# Altium project PCB_Project2.PrjPCB
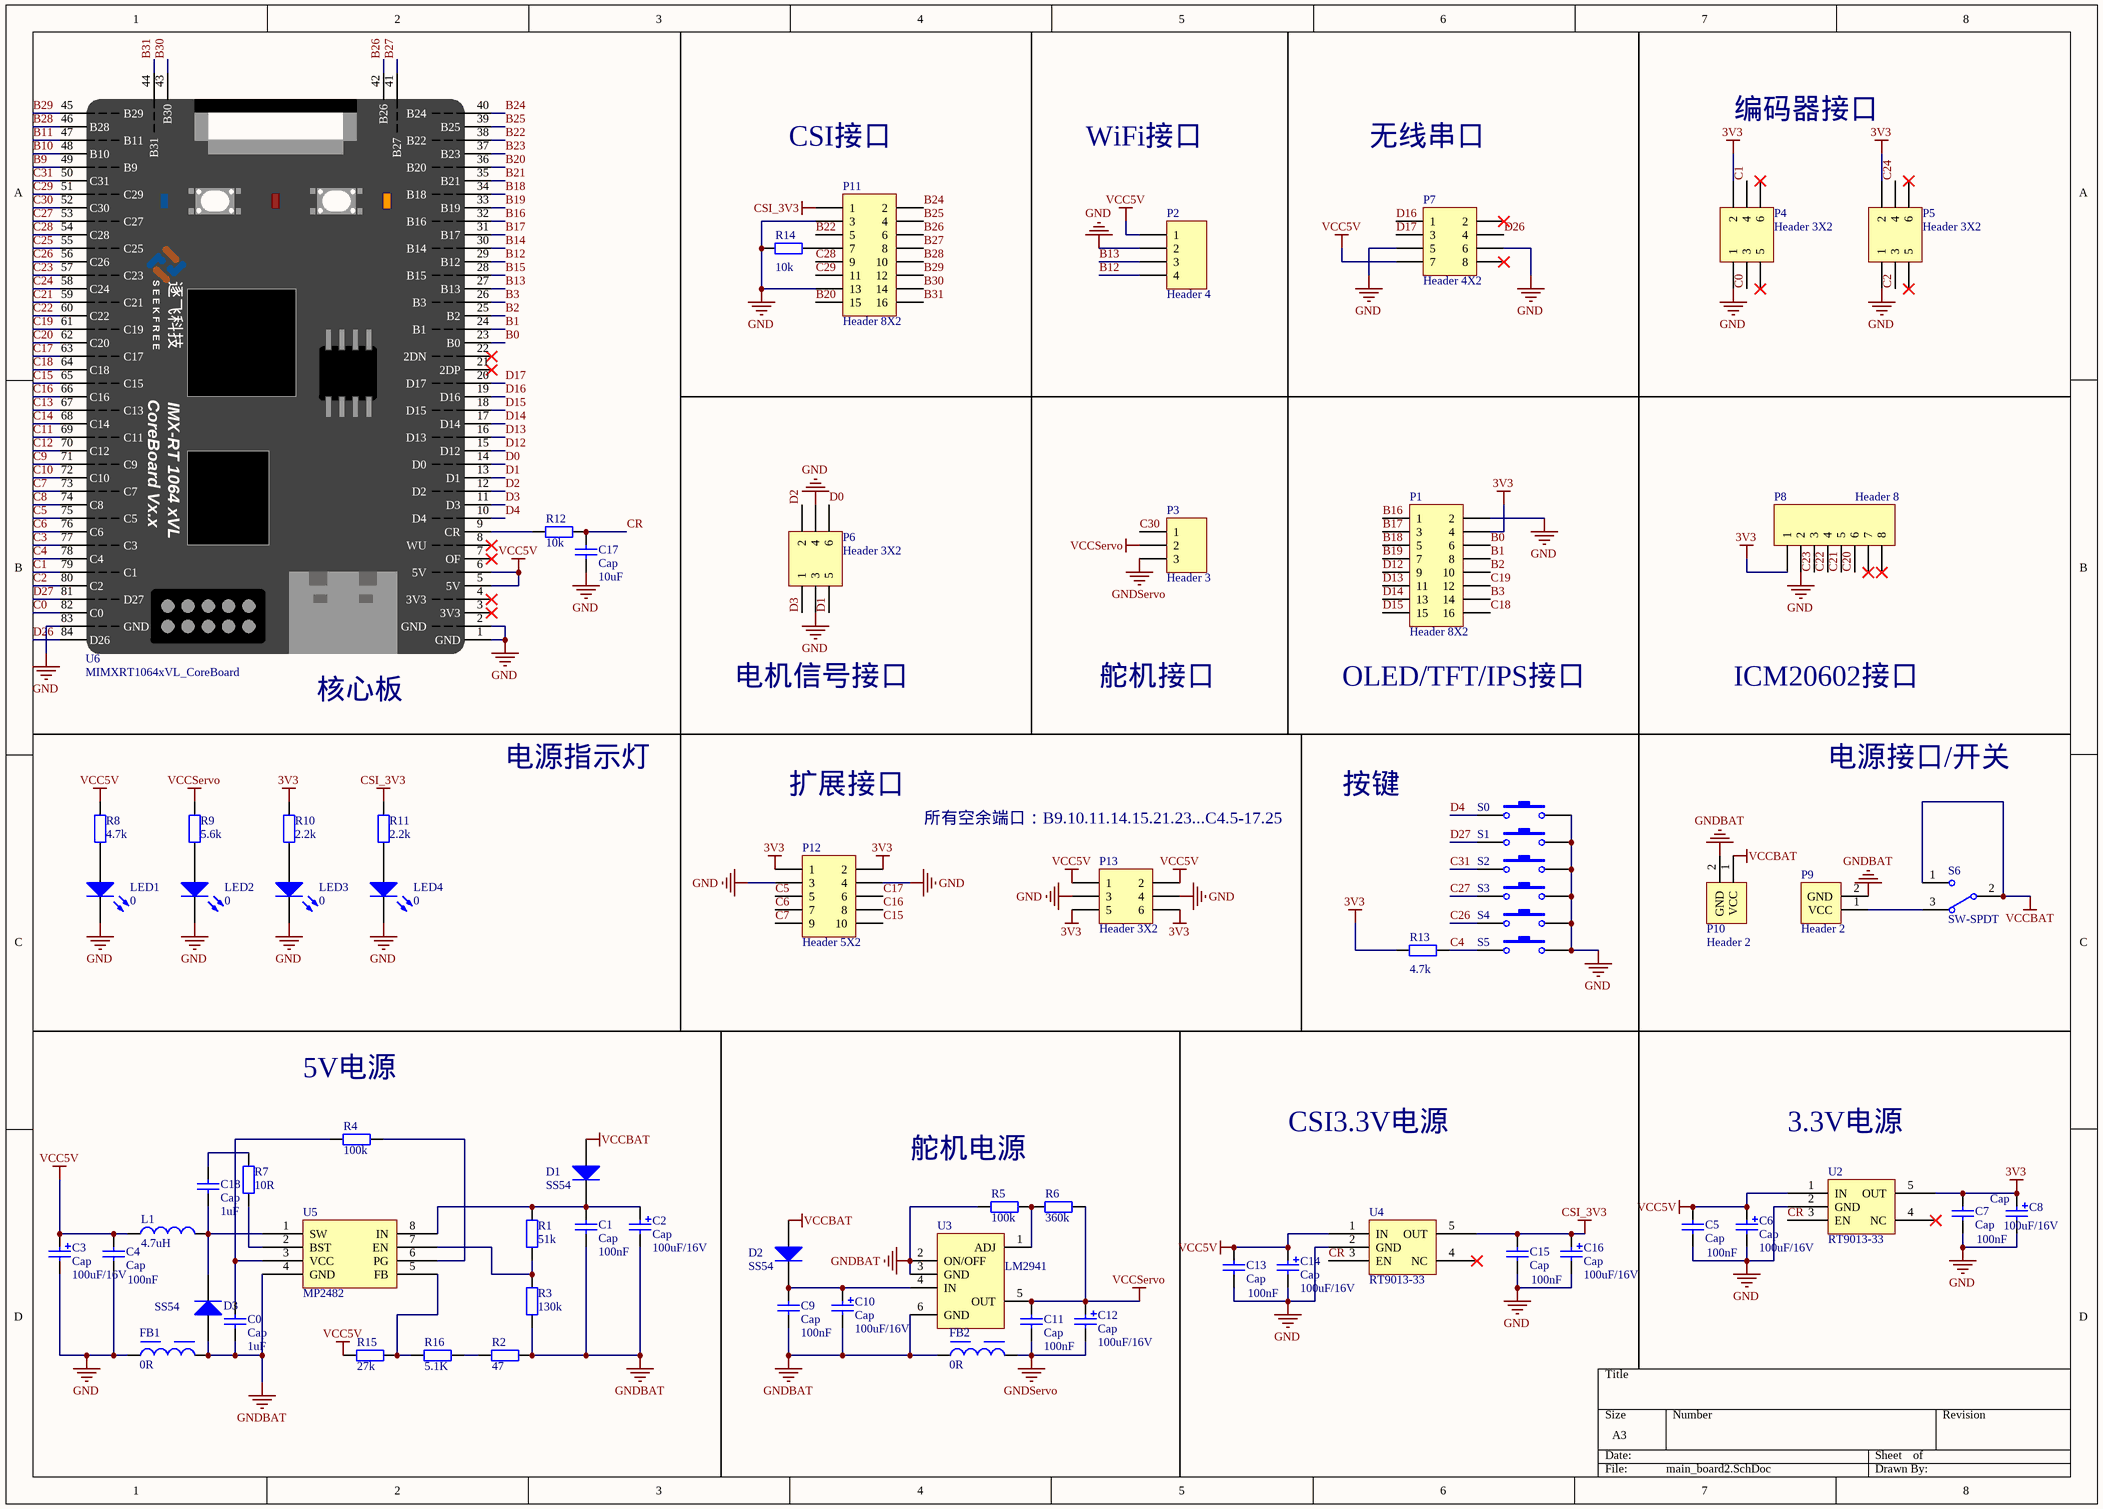
[diagram p0: main_board2.SchDoc]
1 sheet, 70 parts. Net scope: global (net labels, ports and power ports of the same name join across sheets).
Board file: Main_Board2.PcbDoc

## Sheet main_board2.SchDoc
size A3

### Parts
C0  Cap  value 1uF  [0603C]
C1  Cap  value 100nF  [0603C]
C2  Cap  value 100uF/16V  [电解电容]
C3  Cap  value 100uF/16V  [电解电容]
C4  Cap  value 100nF  [0603C]
C5  Cap  value 100nF  [0603C]
C6  Cap  value 100uF/16V  [电解电容]
C7  Cap  value 100nF  [0603C]
C8  Cap  value 100uF/16V  [电解电容]
C9  Cap  value 100nF  [0603C]
C10  Cap  value 100uF/16V  [电解电容]
C11  Cap  value 100nF  [0603C]
C12  Cap  value 100uF/16V  [电解电容]
C13  Cap  value 100nF  [0603C]
C14  Cap  value 100uF/16V  [电解电容]
C15  Cap  value 100nF  [0603C]
C16  Cap  value 100uF/16V  [电解电容]
C17  Cap  value 10uF  [0603C]
C18  Cap  value 1uF  [0603C]
D1  SS54  [ss54]
D2  SS54  [ss54]
D3  SS54  [ss54]
FB1  0R  [0805]
FB2  0R  [0805]
L1  4.7uH  [CD73]
LED1  0  [0603C]
LED2  0  [0603C]
LED3  0  [0603C]
LED4  0  [0603C]
P1  Header 8X2  [HDR2X8]
P2  Header 4  [HDR1X4]
P3  Header 3  [HDR1X3]
P4  Header 3X2  [HDR2X3]
P5  Header 3X2  [HDR2X3]
P6  Header 3X2  [HDR2X3]
P7  Header 4X2  [HDR2X4]
P8  Header 8  [HDR1X8]
P9  Header 2  [VCCBAT]
P10  Header 2  [VCCBAT]
P11  Header 8X2  [HDR2X8]
P12  Header 5X2  [HDR2X5]
P13  Header 3X2  [HDR2X3]
R1  value 51k  [0603R]  (hidden comment: Res2)
R2  value 47  [0603R]  (hidden comment: Res2)
R3  value 130k  [0603R]  (hidden comment: Res2)
R4  value 100k  [0603R]  (hidden comment: Res2)
R5  value 100k  [0603R]  (hidden comment: Res2)
R6  value 360k  [0603R]  (hidden comment: Res2)
R7  value 10R  [0603R]  (hidden comment: Res2)
R8  value 4.7k  [0603R]  (hidden comment: Res2)
R9  value 5.6k  [0603R]  (hidden comment: Res2)
R10  value 2.2k  [0603R]  (hidden comment: Res2)
R11  value 2.2k  [0603R]  (hidden comment: Res2)
R12  value 10k  [0603R]  (hidden comment: Res2)
R13  value 4.7k  [0603R]  (hidden comment: Res2)
R14  value 10k  [0603R]  (hidden comment: Res2)
R15  value 27k  [0603R]  (hidden comment: Res2)
R16  value 5.1K  [0603R]  (hidden comment: Res2)
S0  (no value)  [SPST-2]
S1  (no value)  [SPST-2]
S2  (no value)  [SPST-2]
S3  (no value)  [SPST-2]
S4  (no value)  [SPST-2]
S5  (no value)  [SPST-2]
S6  SW-SPDT  [SW]
U2  RT9013-33  [SOT23-5_L]
U3  LM2941  [TO-263-5L]
U4  RT9013-33  [SOT23-5_L]
U5  MP2482  [SOIC-8]
U6  MIMXRT1064xVL_CoreBoard  [MIMXRT1064xVL_CoreBoard]

### Nets
3V3: C7.2 C8.1 P1.4 P4.2 P5.2 P8.1 P12.1 P12.2 P13.5 P13.6 R10.2 R13.1 U2.5(OUT)
CSI_3V3: C15.2 C16.1 P11.1 R11.2 U4.5(OUT)
GND: C3.2 C4.1 C5.1 C6.2 C7.1 C8.2 C13.1 C14.2 C15.1 C16.2 C17.1 FB1.1 LED1.2(K) LED2.2(K) LED3.2(K) LED4.2(K) P1.2 P2.2 P4.1 P5.1 P6.3 P6.4 P7.5 P7.6 P8.2 P11.3 P11.13 P12.3 P12.4 P13.3 P13.4 R14.1 S0.2 S1.2 S2.2 S3.2 S4.2 S5.2 U2.2(GND) U4.2(GND) U6.1(GND) U6.2(GND) U6.83(GND)
GNDBAT: C0.2 C1.1 C2.2 C9.1 C10.2 D3.1(A) FB1.2 FB2.1 P9.2(GND) P10.2(GND) R2.1 R3.1 R5.1 U3.2(ON/OFF) U3.3(GND) U3.6(GND) U5.4(GND)
GNDServo: C11.1 C12.2 FB2.2 P3.3
VCC5V: C3.1 C4.2 C5.2 C6.1 C13.2 C14.1 L1.1 P2.1 P7.7 P13.1 P13.2 R8.2 R15.2 U2.1(IN) U4.1(IN) U6.5(5V) U6.6(5V)
VCCBAT: D1.1(A) D2.1(A) P10.1(VCC) S6.1 S6.2
VCCServo: C11.2 C12.1 P3.2 R6.2 R9.2 U3.5(OUT)
B0: P1.6 U6.23(B0)
B1: P1.8 U6.24(B1)
B2: P1.10 U6.25(B2)
B3: P1.14 U6.26(B3)
B9: U6.49(B9)
B10: U6.48(B10)
B11: U6.47(B11)
B12: P2.4 U6.29(B12)
B13: P2.3 U6.27(B13)
B14: U6.30(B14)
B15: U6.28(B15)
B16: P1.1 U6.32(B16)
B17: P1.3 U6.31(B17)
B18: P1.5 U6.34(B18)
B19: P1.7 U6.33(B19)
B20: P11.15 U6.36(B20)
B21: U6.35(B21)
B22: P11.5 U6.38(B22)
B23: U6.37(B23)
B24: P11.2 U6.40(B24)
B25: P11.4 U6.39(B25)
B26: P11.6 U6.42(B26)
B27: P11.8 U6.41(B27)
B28: P11.10 U6.46(B28)
B29: P11.12 U6.45(B29)
B30: P11.14 U6.43(B30)
B31: P11.16 U6.44(B31)
C0: P4.3 U6.82(C0)
C1: P4.4 U6.79(C1)
C2: P5.3 U6.80(C2)
C3: U6.77(C3)
C4: R13.2 S5.1 U6.78(C4)
C5: P12.5 U6.75(C5)
C6: P12.7 U6.76(C6)
C7: P12.9 U6.73(C7)
C8: U6.74(C8)
C9: U6.71(C9)
C10: U6.72(C10)
C11: U6.69(C11)
C12: U6.70(C12)
C13: U6.67(C13)
C14: U6.68(C14)
C15: P12.10 U6.65(C15)
C16: P12.8 U6.66(C16)
C17: P12.6 U6.63(C17)
C18: P1.16 U6.64(C18)
C19: P1.12 U6.61(C19)
C20: P8.6 U6.62(C20)
C21: P8.5 U6.59(C21)
C22: P8.4 U6.60(C22)
C23: P8.3 U6.57(C23)
C24: P5.4 U6.58(C24)
C25: U6.55(C25)
C26: S4.1 U6.56(C26)
C27: S3.1 U6.53(C27)
C28: P11.9 U6.54(C28)
C29: P11.11 U6.51(C29)
C30: P3.1 U6.52(C30)
C31: S2.1 U6.50(C31)
CR: C17.2 R12.2 U2.3(EN) U4.3(EN)
D0: P6.6 U6.14(D0)
D1: P6.5 U6.13(D1)
D2: P6.2 U6.12(D2)
D3: P6.1 U6.11(D3)
D4: S0.1 U6.10(D4)
D12: P1.9 U6.15(D12)
D13: P1.11 U6.16(D13)
D14: P1.13 U6.17(D14)
D15: P1.15 U6.18(D15)
D16: P7.1 U6.19(D16)
D17: P7.3 U6.20(D17)
D26: P7.4 U6.84(D26)
D27: S1.1 U6.81(D27)
NetC0_1: C0.1 R4.2 U5.3(VCC)
NetC1_2: C1.2 C2.1 D1.2(K) R1.2 U5.8(IN)
NetC9_2: C9.2 C10.1 D2.2(K) U3.4(IN)
NetC18_1: C18.1 R7.2
NetC18_2: C18.2 D3.2(K) L1.2 U5.1(SW)
NetLED1_1: LED1.1(A) R8.1
NetLED2_1: LED2.1(A) R9.1
NetLED3_1: LED3.1(A) R10.1
NetLED4_1: LED4.1(A) R11.1
NetP9_1: P9.1(VCC) S6.3
NetP11_7: P11.7 R14.2
NetR1_1: R1.1 R3.2 U5.7(EN)
NetR2_2: R2.2 R16.1
NetR4_1: R4.1 U5.6(PG)
NetR5_2: R5.2 R6.1 U3.1(ADJ)
NetR7_1: R7.1 U5.2(BST)
NetR12_1: R12.1 U6.9(CR)
NetR15_1: R15.1 R16.2 U5.5(FB)

Not connected (* = marked no-connect by the designer): P4 5* 6*; P5 5* 6*; P7 2* 8*; P8 7* 8*; U2 4(NC)*; U4 4(NC)*; U6 3(3V3)* 4(3V3)* 7(OF)* 8(WU)* 21(2DP)* 22(2DN)*

### Notes on the sheet
- CSI接口
- WiFi接口
- 无线串口
- 编码器接口
- (near U6) 核心板
- 电机信号接口
- 舵机接口
- (near P1) OLED/TFT/IPS接口
- ICM20602接口
- 电源指示灯
- 电源接口/开关
- 扩展接口
- 所有空余端口：B9.10.11.14.15.21.23...C4.5-17.25
- 按键
- 5V电源
- (near R5) 舵机电源
- CSI3.3V电源
- 3.3V电源
- (in symbol MIMXRT1064xVL_CoreBoard) S E E K F R E E; 逐飞科技; CoreBoard Vx.x; IMX-RT 1064 xVL

### Library data of the parts
C0 C1 C4 C5 C7 C9 C11 C13 C15 C17 C18 = Cap: Capacitor; Published: 8-Jun-2000; LatestRevisionDate: 17-Jul-2002; LatestRevisionNote: Re-released for DXP Platform.; PackageReference: RAD-0.3; Publisher: Altium Limited; PackageDescription: Radial Cap, Thru-Hole; 2 Leads; 0.3 in Pin Spacing
C2 C3 C6 C8 C10 C12 C14 C16 = Cap2: Capacitor; Published: 8-Jun-2000; LatestRevisionDate: 17-Jul-2002; LatestRevisionNote: Re-released for DXP Platform.; PackageReference: RAD-0.3; Publisher: Altium Limited; PackageDescription: Radial Cap, Thru-Hole; 2 Leads; 0.3 in Pin Spacing
D1-D3 = Diode_1: Default Diode; Published: 8-Jun-2000; LatestRevisionDate: 17-Jul-2002; LatestRevisionNote: Re-released for DXP Platform.; PackageVersion: Sep-1996; PackageReference: SMC; Publisher: Altium Limited; PackageDescription: DO-214-AB/SMC; 2 C-Bend Leads; Body 7.9 x 5.9 mm, inc. leads (LxW); Code_JEDEC: DO-214-AB
FB1 FB2 = FB: Inductor; Code_IEC: 1005; Published: 8-Jun-2000; LatestRevisionDate: 29-May-2009; LatestRevisionNote: IPC-7351 Footprint Added.; PackageReference: 0402-A; Publisher: Altium Limited; PackageDescription: Chip Inductor; Code_JEITA: 0402
L1 = Inductor_2: Inductor; Code_IEC: 1005; Published: 8-Jun-2000; LatestRevisionDate: 29-May-2009; LatestRevisionNote: IPC-7351 Footprint Added.; PackageReference: 0402-A; Publisher: Altium Limited; PackageDescription: Chip Inductor; Code_JEITA: 0402
LED1-LED4 = LED2: Typical RED, GREEN, YELLOW, AMBER GaAs LED; Published: 8-Jun-2000; LatestRevisionDate: 17-Jul-2002; LatestRevisionNote: Re-released for DXP Platform.; PackageVersion: Feb-2002; PackageReference: 3.2X1.6X1.1; Publisher: Altium Limited; PackageDescription: SM LED; 2 Flat Leads
P1 P11 = Header 8X2: Header, 8-Pin, Dual row; LatestRevisionDate: 17-Jul-2002; LatestRevisionNote: Re-released for DXP Platform.; Publisher: Altium Limited
P2 = Header 4: Header, 4-Pin; LatestRevisionDate: 17-Jul-2002; LatestRevisionNote: Re-released for DXP Platform.; Publisher: Altium Limited
P3 = Header 3: Header, 3-Pin; LatestRevisionDate: 17-Jul-2002; LatestRevisionNote: Re-released for DXP Platform.; Publisher: Altium Limited
P4-P6 P13 = Header 3X2: Header, 3-Pin, Dual row; LatestRevisionDate: 17-Jul-2002; LatestRevisionNote: Re-released for DXP Platform.; Publisher: Altium Limited
P7 = Header 4X2: Header, 4-Pin, Dual row; LatestRevisionDate: 17-Jul-2002; LatestRevisionNote: Re-released for DXP Platform.; Publisher: Altium Limited
P8 = Header 8: Header, 8-Pin; LatestRevisionDate: 17-Jul-2002; LatestRevisionNote: Re-released for DXP Platform.; Publisher: Altium Limited
P9 = Header 2_1: Header, 2-Pin; LatestRevisionDate: 17-Jul-2002; LatestRevisionNote: Re-released for DXP Platform.; Publisher: Altium Limited
P10 = Header 2_2: Header, 2-Pin; LatestRevisionDate: 17-Jul-2002; LatestRevisionNote: Re-released for DXP Platform.; Publisher: Altium Limited
P12 = Header 5X2: Header, 5-Pin, Dual row; LatestRevisionDate: 17-Jul-2002; LatestRevisionNote: Re-released for DXP Platform.; Publisher: Altium Limited
R1 R2 R4 R5 R7 R8 R10-R16 = Res2: Resistor; Published: 8-Jun-2000; LatestRevisionDate: 17-Jul-2002; LatestRevisionNote: Re-released for DXP Platform.; PackageReference: AXIAL-0.4; Publisher: Altium Limited; PackageDescription: Axial Device, Thru-Hole; 2 Leads; 0.4 in Pin Spacing
R3 = Res2: Resistor 改成了120k; Published: 8-Jun-2000; LatestRevisionDate: 17-Jul-2002; LatestRevisionNote: Re-released for DXP Platform.; PackageReference: AXIAL-0.4; Publisher: Altium Limited; PackageDescription: Axial Device, Thru-Hole; 2 Leads; 0.4 in Pin Spacing
R6 = Res2: Resistor 改成了330k; Published: 8-Jun-2000; LatestRevisionDate: 17-Jul-2002; LatestRevisionNote: Re-released for DXP Platform.; PackageReference: AXIAL-0.4; Publisher: Altium Limited; PackageDescription: Axial Device, Thru-Hole; 2 Leads; 0.4 in Pin Spacing
R9 = Res2: Resistor改成了5.1k; Published: 8-Jun-2000; LatestRevisionDate: 17-Jul-2002; LatestRevisionNote: Re-released for DXP Platform.; PackageReference: AXIAL-0.4; Publisher: Altium Limited; PackageDescription: Axial Device, Thru-Hole; 2 Leads; 0.4 in Pin Spacing
S0-S5 = SW-PB: Switch; Published: 24-Mar-1999; LatestRevisionDate: 17-Jul-2002; LatestRevisionNote: Re-released for DXP Platform.; PackageReference: SPST-2; Publisher: Altium Limited; PackageDescription: Switch; 2 Leads
S6 = SW-SPDT: SPDT Subminiature Toggle Switch, Right Angle Mounting, Vertical Actuation; Published: 24-Mar-1999; LatestRevisionDate: 17-Dec-2003; LatestRevisionNote: Schematic revised, PCB Footprint replaced.; DatasheetVersion: 05-Dec-2000; PackageReference: TL36WW15050; Publisher: Altium Limited; PackageDescription: Switch; 4 Leads; ComponentLink1Description: Manufacturer Link; ComponentLink1URL: http://www.apem.com
U3 = LM2941: Header, 4-Pin; LatestRevisionDate: 17-Jul-2002; LatestRevisionNote: Re-released for DXP Platform.; Publisher: Altium Limited
U6 = MIMXRT1064xVL_CoreBoard: 逐飞科技i.MX RT1064核心板整体原理，可直接使用